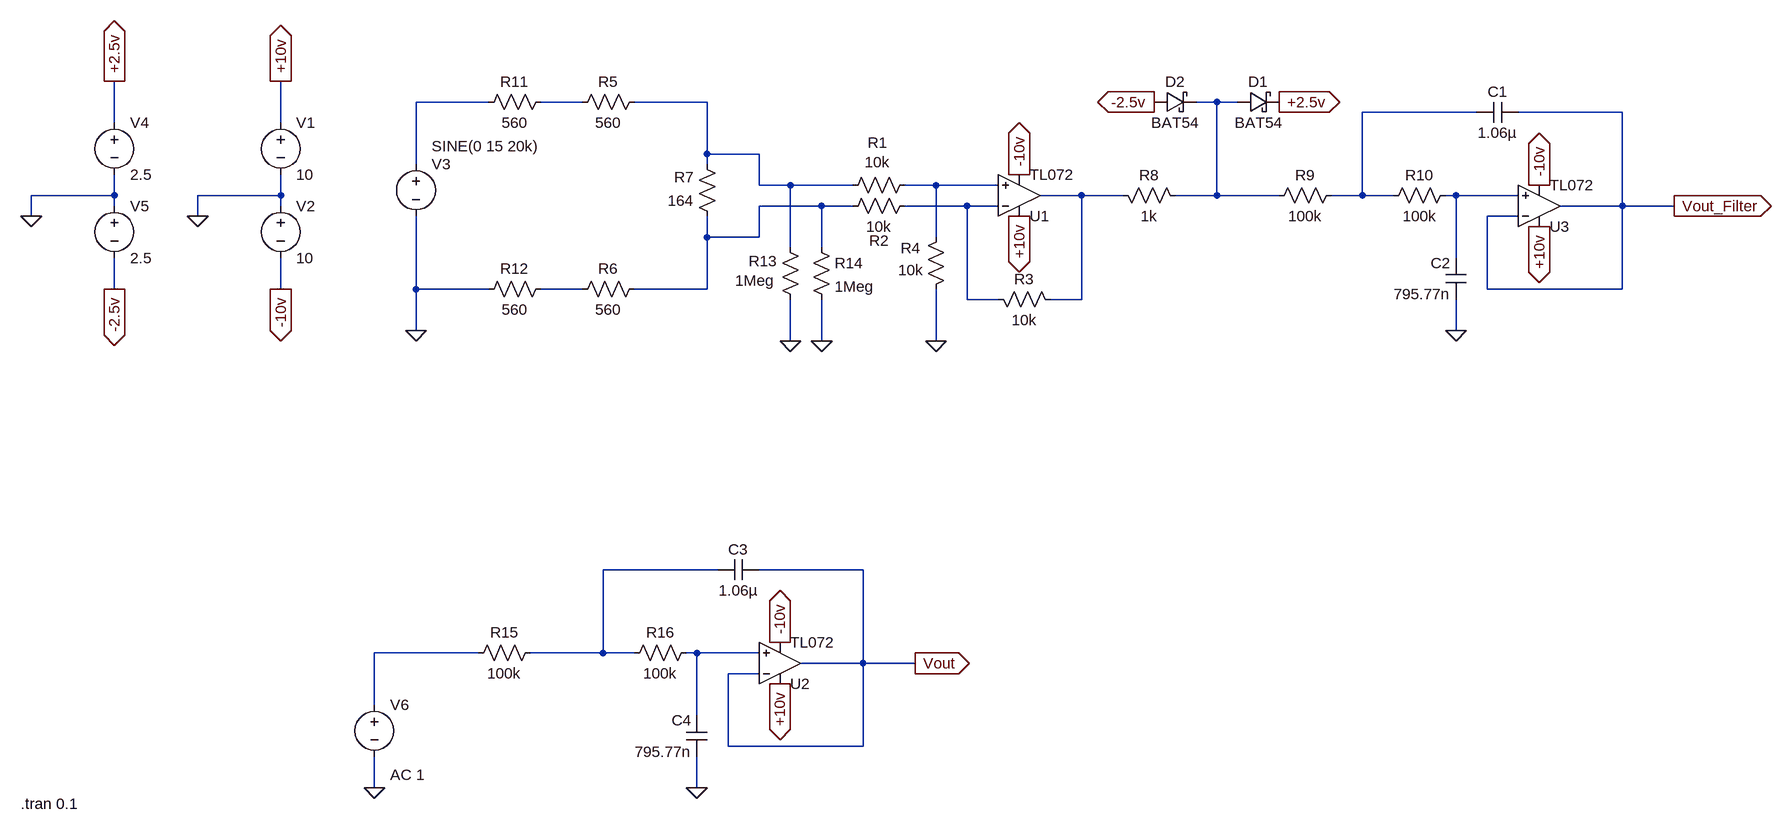
[diagram p0: schematic Atenuador tension.asc]
Atenuador tension.asc, the LTspice schematic file:
Version 4
SHEET 1 2344 1280
WIRE -144 16 -256 16
WIRE 0 16 -64 16
WIRE 192 16 80 16
WIRE 976 16 944 16
WIRE 1008 16 976 16
WIRE 1376 32 1200 32
WIRE 1600 32 1440 32
WIRE -720 48 -720 -16
WIRE -464 48 -464 -16
WIRE 192 96 192 16
WIRE 272 96 192 96
WIRE -256 112 -256 16
WIRE 192 112 192 96
WIRE 272 144 272 96
WIRE 320 144 272 144
WIRE 416 144 320 144
WIRE 544 144 496 144
WIRE 640 144 544 144
WIRE -720 160 -720 128
WIRE -720 160 -848 160
WIRE -464 160 -464 128
WIRE -464 160 -592 160
WIRE 768 160 704 160
WIRE 832 160 768 160
WIRE 976 160 976 16
WIRE 976 160 912 160
WIRE 1072 160 976 160
WIRE 1200 160 1200 32
WIRE 1200 160 1152 160
WIRE 1248 160 1200 160
WIRE 1344 160 1328 160
WIRE 1440 160 1344 160
WIRE -720 176 -720 160
WIRE -464 176 -464 160
WIRE 368 176 272 176
WIRE 416 176 368 176
WIRE 592 176 496 176
WIRE 640 176 592 176
WIRE 1600 176 1600 32
WIRE 1600 176 1504 176
WIRE 1680 176 1600 176
WIRE -848 192 -848 160
WIRE -592 192 -592 160
WIRE 1440 192 1392 192
WIRE 192 224 192 192
WIRE 272 224 272 176
WIRE 272 224 192 224
WIRE 544 224 544 144
WIRE 320 240 320 144
WIRE 368 240 368 176
WIRE 1344 256 1344 160
WIRE -720 304 -720 256
WIRE -464 304 -464 256
WIRE -256 304 -256 192
WIRE -144 304 -256 304
WIRE 0 304 -64 304
WIRE 192 304 192 224
WIRE 192 304 80 304
WIRE 1392 304 1392 192
WIRE 1600 304 1600 176
WIRE 1600 304 1392 304
WIRE 592 320 592 176
WIRE 640 320 592 320
WIRE 768 320 768 160
WIRE 768 320 720 320
WIRE -256 368 -256 304
WIRE 1344 368 1344 320
WIRE 320 384 320 320
WIRE 368 384 368 320
WIRE 544 384 544 304
WIRE 208 736 32 736
WIRE 432 736 272 736
WIRE -160 864 -320 864
WIRE 32 864 32 736
WIRE 32 864 -80 864
WIRE 80 864 32 864
WIRE 176 864 160 864
WIRE 272 864 176 864
WIRE 432 880 432 736
WIRE 432 880 336 880
WIRE 512 880 432 880
WIRE 272 896 224 896
WIRE -320 944 -320 864
WIRE 176 960 176 864
WIRE 224 1008 224 896
WIRE 432 1008 432 880
WIRE 432 1008 224 1008
WIRE -320 1072 -320 1024
WIRE 176 1072 176 1024
FLAG -592 192 0
FLAG -464 -16 +10v
IOPIN -464 -16 Out
FLAG -464 304 -10v
IOPIN -464 304 Out
FLAG 672 192 +10v
IOPIN 672 192 Out
FLAG 672 128 -10v
IOPIN 672 128 Out
FLAG 544 384 0
FLAG -848 192 0
FLAG -720 -16 +2.5v
IOPIN -720 -16 Out
FLAG -720 304 -2.5v
IOPIN -720 304 Out
FLAG 1072 16 +2.5v
IOPIN 1072 16 Out
FLAG 880 16 -2.5v
IOPIN 880 16 Out
FLAG 1344 368 0
FLAG 1680 176 Vout_Filter
IOPIN 1680 176 Out
FLAG 1472 144 -10v
IOPIN 1472 144 Out
FLAG 1472 208 +10v
IOPIN 1472 208 Out
FLAG 368 384 0
FLAG 320 384 0
FLAG -256 368 0
FLAG 176 1072 0
FLAG 512 880 Vout
IOPIN 512 880 Out
FLAG 304 848 -10v
IOPIN 304 848 Out
FLAG 304 912 +10v
IOPIN 304 912 Out
FLAG -320 1072 0
SYMBOL AutoGenerated\\TL072 672 160 M180
SYMATTR InstName U1
SYMBOL voltage -464 32 R0
WINDOW 123 0 0 Left 0
WINDOW 39 0 0 Left 0
SYMATTR InstName V1
SYMATTR Value 10
SYMBOL voltage -464 160 R0
WINDOW 123 0 0 Left 0
WINDOW 39 0 0 Left 0
SYMATTR InstName V2
SYMATTR Value 10
SYMBOL res 512 128 R90
WINDOW 0 -34 58 VBottom 2
WINDOW 3 -35 58 VTop 2
SYMATTR InstName R1
SYMATTR Value 10k
SYMBOL res 512 160 R90
WINDOW 0 85 55 VBottom 2
WINDOW 3 32 56 VTop 2
SYMATTR InstName R2
SYMATTR Value 10k
SYMBOL res 736 336 M270
WINDOW 0 32 56 VTop 2
WINDOW 3 0 56 VBottom 2
SYMATTR InstName R3
SYMATTR Value 10k
SYMBOL res 528 320 M180
WINDOW 0 -38 79 Left 2
WINDOW 3 -42 45 Left 2
SYMATTR InstName R4
SYMATTR Value 10k
SYMBOL voltage -256 96 R0
WINDOW 123 24 68 Left 2
WINDOW 39 0 0 Left 0
WINDOW 3 24 -12 Left 2
SYMATTR Value SINE(0 15 20k)
SYMATTR InstName V3
SYMBOL res 96 0 R90
WINDOW 0 0 56 VBottom 2
WINDOW 3 32 56 VTop 2
SYMATTR InstName R5
SYMATTR Value 560
SYMBOL res 96 288 R90
WINDOW 0 0 56 VBottom 2
WINDOW 3 32 56 VTop 2
SYMATTR InstName R6
SYMATTR Value 560
SYMBOL res 208 208 R180
WINDOW 0 36 76 Left 2
WINDOW 3 36 40 Left 2
SYMATTR InstName R7
SYMATTR Value 164
SYMBOL voltage -720 32 R0
WINDOW 123 0 0 Left 0
WINDOW 39 0 0 Left 0
SYMATTR InstName V4
SYMATTR Value 2.5
SYMBOL voltage -720 160 R0
WINDOW 123 0 0 Left 0
WINDOW 39 0 0 Left 0
SYMATTR InstName V5
SYMATTR Value 2.5
SYMBOL schottky 1008 32 R270
WINDOW 0 32 32 VTop 2
WINDOW 3 0 32 VBottom 2
SYMATTR InstName D1
SYMATTR Value BAT54
SYMATTR Description Diode
SYMATTR Type diode
SYMBOL schottky 880 32 R270
WINDOW 0 32 32 VTop 2
WINDOW 3 0 32 VBottom 2
SYMATTR InstName D2
SYMATTR Value BAT54
SYMATTR Description Diode
SYMATTR Type diode
SYMBOL res 928 176 M270
WINDOW 0 32 56 VTop 2
WINDOW 3 0 56 VBottom 2
SYMATTR InstName R8
SYMATTR Value 1k
SYMBOL res 1168 144 R90
WINDOW 0 0 56 VBottom 2
WINDOW 3 32 56 VTop 2
SYMATTR InstName R9
SYMATTR Value 100k
SYMBOL res 1344 144 R90
WINDOW 0 0 56 VBottom 2
WINDOW 3 32 56 VTop 2
SYMATTR InstName R10
SYMATTR Value 100k
SYMBOL cap 1440 16 R90
WINDOW 0 0 32 VBottom 2
WINDOW 3 32 32 VTop 2
SYMATTR InstName C1
SYMATTR Value 1.06µ
SYMBOL cap 1360 320 R180
WINDOW 0 24 56 Left 2
WINDOW 3 24 8 Left 2
SYMATTR InstName C2
SYMATTR Value 795.77n
SYMBOL AutoGenerated\\TL072 1472 176 M180
SYMATTR InstName U3
SYMBOL res -48 0 R90
WINDOW 0 0 56 VBottom 2
WINDOW 3 32 56 VTop 2
SYMATTR InstName R11
SYMATTR Value 560
SYMBOL res -48 288 R90
WINDOW 0 0 56 VBottom 2
WINDOW 3 32 56 VTop 2
SYMATTR InstName R12
SYMATTR Value 560
SYMBOL res 304 224 R0
WINDOW 0 -48 37 Left 2
WINDOW 3 -69 67 Left 2
SYMATTR InstName R13
SYMATTR Value 1Meg
SYMBOL res 352 224 R0
SYMATTR InstName R14
SYMATTR Value 1Meg
SYMBOL res -64 848 R90
WINDOW 0 0 56 VBottom 2
WINDOW 3 32 56 VTop 2
SYMATTR InstName R15
SYMATTR Value 100k
SYMBOL res 176 848 R90
WINDOW 0 0 56 VBottom 2
WINDOW 3 32 56 VTop 2
SYMATTR InstName R16
SYMATTR Value 100k
SYMBOL cap 272 720 R90
WINDOW 0 0 32 VBottom 2
WINDOW 3 32 32 VTop 2
SYMATTR InstName C3
SYMATTR Value 1.06µ
SYMBOL cap 192 1024 R180
WINDOW 0 24 56 Left 2
WINDOW 3 24 8 Left 2
SYMATTR InstName C4
SYMATTR Value 795.77n
SYMBOL AutoGenerated\\TL072 304 880 M180
SYMATTR InstName U2
SYMBOL voltage -320 928 R0
WINDOW 123 24 124 Left 2
WINDOW 39 0 0 Left 0
SYMATTR InstName V6
SYMATTR Value ""
SYMATTR Value2 AC 1
TEXT -864 1096 Left 2 !.tran 0.1

The netlist it stands for:
* Atenuador tension.asc
* U1: TL072 (symbol AutoGenerated\TL072 not available, pins judged from their places): In+=N006 In-=N010 V+=+10v V-=-10v OUT=N007
V1 +10v 0 10
V2 0 -10v 10
R1 N006 N003 10k
R2 N010 N009 10k
R3 N007 N010 10k
R4 0 N006 10k
V3 N001 0 SINE(0 15 20k)
R5 N003 N002 560
R6 N009 N011 560
R7 N009 N003 164
V4 +2.5v 0 2.5
V5 0 -2.5v 2.5
D1 N004 +2.5v BAT54
D2 -2.5v N004 BAT54
R8 N004 N007 1k
R9 N005 N004 100k
R10 N008 N005 100k
C1 Vout_Filter N005 1.06µ
C2 0 N008 795.77n
* U3: TL072 (symbol AutoGenerated\TL072 not available, pins judged from their places): In+=N008 In-=Vout_Filter V+=+10v V-=-10v OUT=Vout_Filter
R11 N002 N001 560
R12 N011 0 560
R13 N003 0 1Meg
R14 N009 0 1Meg
R15 N012 N013 100k
R16 N014 N012 100k
C3 Vout N012 1.06µ
C4 0 N014 795.77n
* U2: TL072 (symbol AutoGenerated\TL072 not available, pins judged from their places): In+=N014 In-=Vout V+=+10v V-=-10v OUT=Vout
V6 N013 0 AC 1
.model D D
.lib standard.dio
.tran 0.1
.backanno
.end